# Altium project BMU_v50.PrjPcb (part 3 of 5)

## Sheet BMU_V50_CellBalanceIC.SchDoc
size C
Used 2 times, as channels StringA/U_BMU_V50_CellBalancer/U_BMU_V50_CellBalanceIC, StringB/U_BMU_V50_CellBalancer/U_BMU_V50_CellBalanceIC. Parts and nets are listed once, with the designators drawn on the sheet.
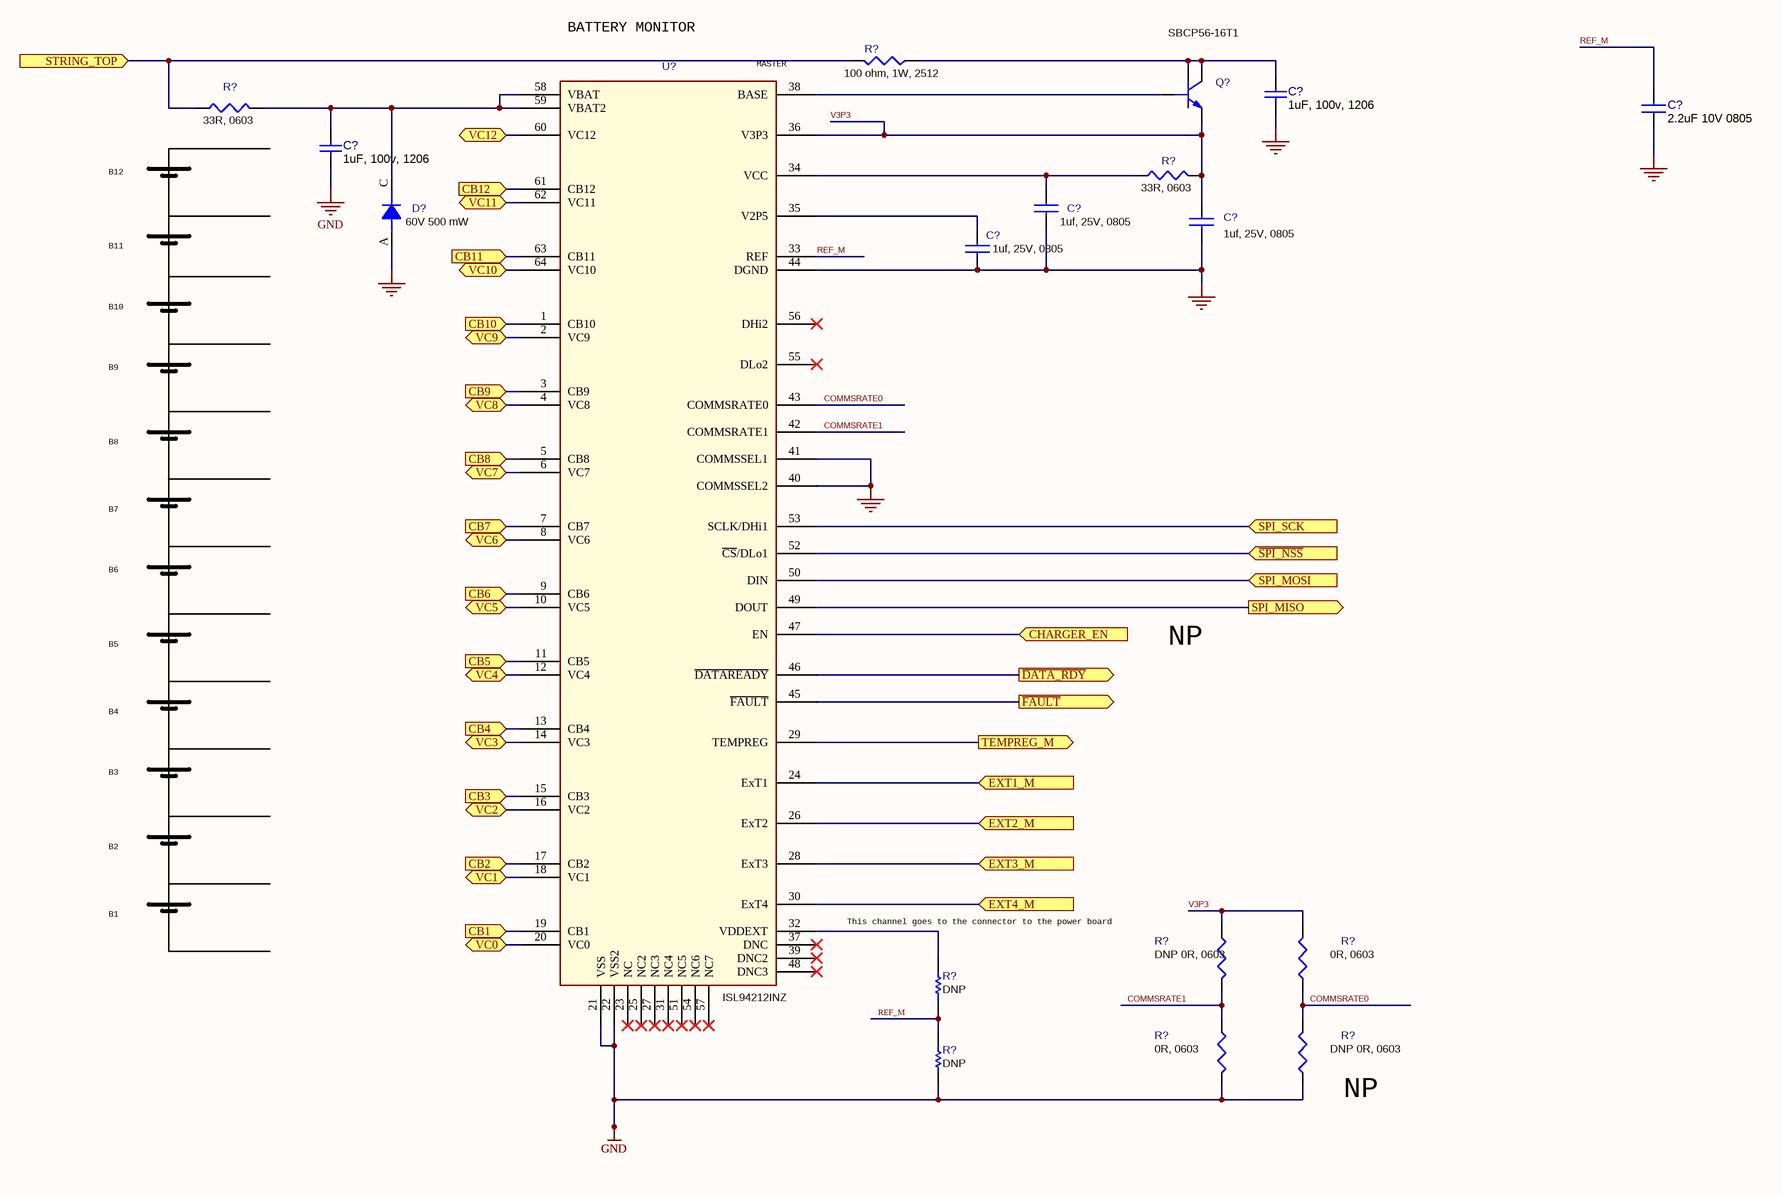
[diagram p6: BMU_V50_CellBalanceIC.SchDoc]

### Parts
(Parts that share a designator on the sheet are numbered #1, #2 ... from top to bottom, then left to right.)
C?#1  1uF, 100v, 1206  [C1206]
C?#2  2.2uF 10V 0805  [C0805]
C?#3  1uF, 100v, 1206  [C1206]
C?#4  1uf, 25V, 0805  [C0805]
C?#5  1uf, 25V, 0805  [C0805]
C?#6  1uf, 25V, 0805  [C0805]
D?  60V 500 mW  [SOD-123]
Q?  SBCP56-16T1  [SOT-223]
R?#1  100 ohm, 1W, 2512  [2512]
R?#2  33R, 0603  [R0603]
R?#3  33R, 0603  [R0603]
R?#4  DNP 0R, 0603  [R0603]  (no BOM)
R?#5  0R, 0603  [R0603]
R?#6  DNP  [R0402]  (no BOM)
R?#7  0R, 0603  [R0603]
R?#8  DNP 0R, 0603  [R0603]  (no BOM)
R?#9  DNP  [R0402]  (no BOM)
U?  ISL94212INZ  [TQFP-64]

### Ports
CB1 (in), CB2 (in), CB3 (in), CB4 (in), CB5 (in), CB6 (in), CB7 (in), CB8 (in), CB9 (in), CB10 (in), CB11 (in), CB12 (in), CHARGER_EN (in), EXT1_M (in), EXT2_M (in), EXT3_M (in), EXT4_M (in), SPI_MISO (out), SPI_MOSI (in), SPI_SCK (in), STRING_TOP (in), TEMPREG_M (out), VC0 (bidir), VC1 (bidir), VC2 (bidir), VC3 (bidir), VC4 (bidir), VC5 (bidir), VC6 (bidir), VC7 (bidir), VC8 (bidir), VC9 (bidir), VC10 (bidir), VC11 (bidir), VC12 (bidir), ~{DATA_RDY} (out), ~{FAULT} (out), ~{SPI_NSS} (in)

### Nets
GND: C?#1.2 C?#2.1 C?#3.1 C?#4.2 C?#5.2 C?#6.2 D?.A(ANODE) R?#7.2 R?#8.2 R?#9.1 U?.21(VSS) U?.22(VSS2) U?.40(COMMSSEL2) U?.41(COMMSSEL1) U?.44(DGND)
CB1: U?.19(CB1) ; port CB1
CB2: U?.17(CB2) ; port CB2
CB3: U?.15(CB3) ; port CB3
CB4: U?.13(CB4) ; port CB4
CB5: U?.11(CB5) ; port CB5
CB6: U?.9(CB6) ; port CB6
CB7: U?.7(CB7) ; port CB7
CB8: U?.5(CB8) ; port CB8
CB9: U?.3(CB9) ; port CB9
CB10: U?.1(CB10) ; port CB10
CB11: U?.63(CB11) ; port CB11
CB12: U?.61(CB12) ; port CB12
CHARGER_EN: U?.47(EN) ; port CHARGER_EN
COMMSRATE0: R?#5.2 R?#8.1 U?.43(COMMSRATE0)
COMMSRATE1: R?#4.2 R?#7.1 U?.42(COMMSRATE1)
~{DATA_RDY}: U?.46(~{DATAREADY}) ; port ~{DATA_RDY}
EXT1_M: U?.24(ExT1) ; port EXT1_M
EXT2_M: U?.26(ExT2) ; port EXT2_M
EXT3_M: U?.28(ExT3) ; port EXT3_M
EXT4_M: U?.30(ExT4) ; port EXT4_M
~{FAULT}: U?.45(~{FAULT}) ; port ~{FAULT}
REF_M: C?#2.2 R?#6.1 R?#9.2 U?.33(REF)
~{SPI_NSS}: U?.52(~{CS}/DLo1) ; port ~{SPI_NSS}
SPI_MISO: U?.49(DOUT) ; port SPI_MISO
SPI_MOSI: U?.50(DIN) ; port SPI_MOSI
SPI_SCK: U?.53(SCLK/DHi1) ; port SPI_SCK
STRING_TOP: R?#1.2 R?#2.1 ; port STRING_TOP
TEMPREG_M: U?.29(TEMPREG) ; port TEMPREG_M
V3P3: C?#5.1 Q?.3(E) R?#3.2 R?#4.1 R?#5.1 U?.36(V3P3)
VC0: U?.20(VC0) ; port VC0
VC1: U?.18(VC1) ; port VC1
VC2: U?.16(VC2) ; port VC2
VC3: U?.14(VC3) ; port VC3
VC4: U?.12(VC4) ; port VC4
VC5: U?.10(VC5) ; port VC5
VC6: U?.8(VC6) ; port VC6
VC7: U?.6(VC7) ; port VC7
VC8: U?.4(VC8) ; port VC8
VC9: U?.2(VC9) ; port VC9
VC10: U?.64(VC10) ; port VC10
VC11: U?.62(VC11) ; port VC11
VC12: U?.60(VC12) ; port VC12
NetC?#1_1: C?#1.1 Q?.2(C) Q?.4(C) R?#1.1
NetC?#3_2: C?#3.2 D?.C(CATHODE) R?#2.2 U?.58(VBAT) U?.59(VBAT2)
NetC?#4_1: C?#4.1 R?#3.1 U?.34(VCC)
NetC?#6_1: C?#6.1 U?.35(V2P5)
NetQ?_1: Q?.1(B) U?.38(BASE)
NetR?#6_2: R?#6.2 U?.32(VDDEXT)

Not connected (* = marked no-connect by the designer): U? 23(NC)* 25(NC2)* 27(NC3)* 31(NC4)* 37(DNC)* 39(DNC2)* 48(DNC3)* 51(NC5)* 54(NC6)* 55(DLo2)* 56(DHi2)* 57(NC7)*

### Channels
StringA/U_BMU_V50_CellBalancer/U_BMU_V50_CellBalanceIC: designators C?=C?_StringA_U_BMU_V50_CellBalancer_U_BMU_V50_CellBalanceIC#5 C?=C?_StringA_U_BMU_V50_CellBalancer_U_BMU_V50_CellBalanceIC#6 C?=C?_StringA_U_BMU_V50_CellBalancer_U_BMU_V50_CellBalanceIC#4 C?=C?_StringA_U_BMU_V50_CellBalancer_U_BMU_V50_CellBalanceIC#1 C?=C?_StringA_U_BMU_V50_CellBalancer_U_BMU_V50_CellBalanceIC#3 C?=C?_StringA_U_BMU_V50_CellBalancer_U_BMU_V50_CellBalanceIC#2 D?=D?_StringA_U_BMU_V50_CellBalancer_U_BMU_V50_CellBalanceIC Q?=Q?_StringA_U_BMU_V50_CellBalancer_U_BMU_V50_CellBalanceIC R?=R?_StringA_U_BMU_V50_CellBalancer_U_BMU_V50_CellBalanceIC#4 R?=R?_StringA_U_BMU_V50_CellBalancer_U_BMU_V50_CellBalanceIC#8 R?=R?_StringA_U_BMU_V50_CellBalancer_U_BMU_V50_CellBalanceIC#2 R?=R?_StringA_U_BMU_V50_CellBalancer_U_BMU_V50_CellBalanceIC#5 R?=R?_StringA_U_BMU_V50_CellBalancer_U_BMU_V50_CellBalanceIC#7 R?=R?_StringA_U_BMU_V50_CellBalancer_U_BMU_V50_CellBalanceIC#1 R?=R?_StringA_U_BMU_V50_CellBalancer_U_BMU_V50_CellBalanceIC#6 R?=R?_StringA_U_BMU_V50_CellBalancer_U_BMU_V50_CellBalanceIC#9 R?=R?_StringA_U_BMU_V50_CellBalancer_U_BMU_V50_CellBalanceIC#3 U?=U?_StringA_U_BMU_V50_CellBalancer_U_BMU_V50_CellBalanceIC; ports CB1=NetR?_StringA_U_BMU_V50_CellBalancer_U_BMU_V50_CellBalanceTaps#52_2 CB2=NetR?_StringA_U_BMU_V50_CellBalancer_U_BMU_V50_CellBalanceTaps#44_2 CB3=NetR?_StringA_U_BMU_V50_CellBalancer_U_BMU_V50_CellBalanceTaps#35_2 CB4=NetR?_StringA_U_BMU_V50_CellBalancer_U_BMU_V50_CellBalanceTaps#24_2 CB5=NetR?_StringA_U_BMU_V50_CellBalancer_U_BMU_V50_CellBalanceTaps#11_2 CB6=NetR?_StringA_U_BMU_V50_CellBalancer_U_BMU_V50_CellBalanceTaps#60_2 CB7=NetR?_StringA_U_BMU_V50_CellBalancer_U_BMU_V50_CellBalanceTaps#53_2 CB8=NetR?_StringA_U_BMU_V50_CellBalancer_U_BMU_V50_CellBalanceTaps#40_2 CB9=NetR?_StringA_U_BMU_V50_CellBalancer_U_BMU_V50_CellBalanceTaps#29_2 CB10=NetR?_StringA_U_BMU_V50_CellBalancer_U_BMU_V50_CellBalanceTaps#8_2 CB11=NetR?_StringA_U_BMU_V50_CellBalancer_U_BMU_V50_CellBalanceTaps#22_2 CB12=NetR?_StringA_U_BMU_V50_CellBalancer_U_BMU_V50_CellBalanceTaps#7_2 CHARGER_EN=NetU?#1_55 EXT1_M=NetR?_StringA_U_BMU_V50_CellBalancer_EXT_MEAS1#2_2 EXT2_M=NetR?_StringA_U_BMU_V50_CellBalancer_EXT_MEAS2#2_2 EXT3_M=NetR?_StringA_U_BMU_V50_CellBalancer_EXT_MEAS3#2_2 EXT4_M=NetR?_StringA_U_BMU_V50_CellBalancer_EXT_MEAS4#2_2 SPI_MISO=SPI_MISO SPI_MOSI=SPI_MOSI SPI_SCK=SPI_SCK STRING_TOP=NetC?_StringA_U_BMU_V50_StringPWRControl#1_1 TEMPREG_M=NetR?_StringA_U_BMU_V50_CellBalancer_EXT_MEAS1#1_2 VC0=NetC?_StringA_U_BMU_V50_CellBalancer_U_BMU_V50_CellBalanceTaps#33_1 VC1=NetC?_StringA_U_BMU_V50_CellBalancer_U_BMU_V50_CellBalanceTaps#28_1 VC2=NetC?_StringA_U_BMU_V50_CellBalancer_U_BMU_V50_CellBalanceTaps#23_1 VC3=NetC?_StringA_U_BMU_V50_CellBalancer_U_BMU_V50_CellBalanceTaps#17_1 VC4=NetC?_StringA_U_BMU_V50_CellBalancer_U_BMU_V50_CellBalanceTaps#11_1 VC5=NetC?_StringA_U_BMU_V50_CellBalancer_U_BMU_V50_CellBalanceTaps#2_1 VC6=NetC?_StringA_U_BMU_V50_CellBalancer_U_BMU_V50_CellBalanceTaps#35_1 VC7=NetC?_StringA_U_BMU_V50_CellBalancer_U_BMU_V50_CellBalanceTaps#29_1 VC8=NetC?_StringA_U_BMU_V50_CellBalancer_U_BMU_V50_CellBalanceTaps#22_1 VC9=NetC?_StringA_U_BMU_V50_CellBalancer_U_BMU_V50_CellBalanceTaps#10_1 VC10=NetC?_StringA_U_BMU_V50_CellBalancer_U_BMU_V50_CellBalanceTaps#7_1 VC11=NetC?_StringA_U_BMU_V50_CellBalancer_U_BMU_V50_CellBalanceTaps#12_1 VC12=NetC?_StringA_U_BMU_V50_CellBalancer_U_BMU_V50_CellBalanceTaps#1_1 ~{DATA_RDY}=NetU?#1_25 ~{FAULT}=NetD?#4_2 ~{SPI_NSS}=~{SPI_CS_BAL1}
StringB/U_BMU_V50_CellBalancer/U_BMU_V50_CellBalanceIC: designators C?=C?_StringB_U_BMU_V50_CellBalancer_U_BMU_V50_CellBalanceIC#5 C?=C?_StringB_U_BMU_V50_CellBalancer_U_BMU_V50_CellBalanceIC#6 C?=C?_StringB_U_BMU_V50_CellBalancer_U_BMU_V50_CellBalanceIC#4 C?=C?_StringB_U_BMU_V50_CellBalancer_U_BMU_V50_CellBalanceIC#1 C?=C?_StringB_U_BMU_V50_CellBalancer_U_BMU_V50_CellBalanceIC#3 C?=C?_StringB_U_BMU_V50_CellBalancer_U_BMU_V50_CellBalanceIC#2 D?=D?_StringB_U_BMU_V50_CellBalancer_U_BMU_V50_CellBalanceIC Q?=Q?_StringB_U_BMU_V50_CellBalancer_U_BMU_V50_CellBalanceIC R?=R?_StringB_U_BMU_V50_CellBalancer_U_BMU_V50_CellBalanceIC#4 R?=R?_StringB_U_BMU_V50_CellBalancer_U_BMU_V50_CellBalanceIC#8 R?=R?_StringB_U_BMU_V50_CellBalancer_U_BMU_V50_CellBalanceIC#2 R?=R?_StringB_U_BMU_V50_CellBalancer_U_BMU_V50_CellBalanceIC#5 R?=R?_StringB_U_BMU_V50_CellBalancer_U_BMU_V50_CellBalanceIC#7 R?=R?_StringB_U_BMU_V50_CellBalancer_U_BMU_V50_CellBalanceIC#1 R?=R?_StringB_U_BMU_V50_CellBalancer_U_BMU_V50_CellBalanceIC#6 R?=R?_StringB_U_BMU_V50_CellBalancer_U_BMU_V50_CellBalanceIC#9 R?=R?_StringB_U_BMU_V50_CellBalancer_U_BMU_V50_CellBalanceIC#3 U?=U?_StringB_U_BMU_V50_CellBalancer_U_BMU_V50_CellBalanceIC; ports CB1=NetR?_StringB_U_BMU_V50_CellBalancer_U_BMU_V50_CellBalanceTaps#52_2 CB2=NetR?_StringB_U_BMU_V50_CellBalancer_U_BMU_V50_CellBalanceTaps#44_2 CB3=NetR?_StringB_U_BMU_V50_CellBalancer_U_BMU_V50_CellBalanceTaps#35_2 CB4=NetR?_StringB_U_BMU_V50_CellBalancer_U_BMU_V50_CellBalanceTaps#24_2 CB5=NetR?_StringB_U_BMU_V50_CellBalancer_U_BMU_V50_CellBalanceTaps#11_2 CB6=NetR?_StringB_U_BMU_V50_CellBalancer_U_BMU_V50_CellBalanceTaps#60_2 CB7=NetR?_StringB_U_BMU_V50_CellBalancer_U_BMU_V50_CellBalanceTaps#53_2 CB8=NetR?_StringB_U_BMU_V50_CellBalancer_U_BMU_V50_CellBalanceTaps#40_2 CB9=NetR?_StringB_U_BMU_V50_CellBalancer_U_BMU_V50_CellBalanceTaps#29_2 CB10=NetR?_StringB_U_BMU_V50_CellBalancer_U_BMU_V50_CellBalanceTaps#8_2 CB11=NetR?_StringB_U_BMU_V50_CellBalancer_U_BMU_V50_CellBalanceTaps#22_2 CB12=NetR?_StringB_U_BMU_V50_CellBalancer_U_BMU_V50_CellBalanceTaps#7_2 CHARGER_EN=NetU?#1_55 EXT1_M=NetR?_StringB_U_BMU_V50_CellBalancer_EXT_MEAS1#2_2 EXT2_M=NetR?_StringB_U_BMU_V50_CellBalancer_EXT_MEAS2#2_2 EXT3_M=NetR?_StringB_U_BMU_V50_CellBalancer_EXT_MEAS3#2_2 EXT4_M=NetR?_StringB_U_BMU_V50_CellBalancer_EXT_MEAS4#2_2 SPI_MISO=SPI_MISO SPI_MOSI=SPI_MOSI SPI_SCK=SPI_SCK STRING_TOP=NetC?_StringB_U_BMU_V50_StringPWRControl#1_1 TEMPREG_M=NetR?_StringB_U_BMU_V50_CellBalancer_EXT_MEAS1#1_2 VC0=NetC?_StringB_U_BMU_V50_CellBalancer_U_BMU_V50_CellBalanceTaps#33_1 VC1=NetC?_StringB_U_BMU_V50_CellBalancer_U_BMU_V50_CellBalanceTaps#28_1 VC2=NetC?_StringB_U_BMU_V50_CellBalancer_U_BMU_V50_CellBalanceTaps#23_1 VC3=NetC?_StringB_U_BMU_V50_CellBalancer_U_BMU_V50_CellBalanceTaps#17_1 VC4=NetC?_StringB_U_BMU_V50_CellBalancer_U_BMU_V50_CellBalanceTaps#11_1 VC5=NetC?_StringB_U_BMU_V50_CellBalancer_U_BMU_V50_CellBalanceTaps#2_1 VC6=NetC?_StringB_U_BMU_V50_CellBalancer_U_BMU_V50_CellBalanceTaps#35_1 VC7=NetC?_StringB_U_BMU_V50_CellBalancer_U_BMU_V50_CellBalanceTaps#29_1 VC8=NetC?_StringB_U_BMU_V50_CellBalancer_U_BMU_V50_CellBalanceTaps#22_1 VC9=NetC?_StringB_U_BMU_V50_CellBalancer_U_BMU_V50_CellBalanceTaps#10_1 VC10=NetC?_StringB_U_BMU_V50_CellBalancer_U_BMU_V50_CellBalanceTaps#7_1 VC11=NetC?_StringB_U_BMU_V50_CellBalancer_U_BMU_V50_CellBalanceTaps#12_1 VC12=NetC?_StringB_U_BMU_V50_CellBalancer_U_BMU_V50_CellBalanceTaps#1_1 ~{DATA_RDY}=NetU?#1_37 ~{FAULT}=NetD?#5_2 ~{SPI_NSS}=~{SPI_CS_BAL2}

### Notes on the sheet
- BATTERY MONITOR
- (near U?) MASTER
- B12
- B11
- B10
- B9
- B8
- B7
- B6
- B5
- NP
- B4
- B3
- B2
- B1
- (near R?#6) This channel goes to the connector to the power board
- (near R?#8) NP
- Title
- MATTERNET
- PROPRIETRY & CONFIDENTIAL
  THE INFORMATION CONTAINS IN THIS DRAWING
  IS THE SOLE PROPERTY OF  MATTERNET Inc.
  ANY REPRODUCTION IN PART OR AS WHOLE
  WITHOUT A WRITTEN PERMISSION OF
  MATTERNET Inc. IS PROHIBITED
- Size:
- Date:
- File:
- C
- Number:
- Time:
- Revision:
- Sheet
- of
- 161 E. Evelyn Ave.
- Mountain View,
- CA 94041 USA

### Library data of the parts
C?#1 C?#3 = Cap: CAP CER 1UF 100V X7R 1210 AUTO F; Manufacturer: KEMET; Manufacturer Part Number: C1210X105K1RACAUTO; Dielectric Material: Ceramic; Tolerance: 10%; Supplier 1: Digi-Key; Supplier Part Number 1: 399-16434-1-ND; Stock 1: 335; Pricing 1: 1=2.07, 10=1.677, 100=1.2803, 500=0.9755, 1000=0.85356 (USD); Case/Package: 1210; Voltage Rating (DC): 100V; Dielectric: X7R; Capacitance: 1uF
C?#2 = CAP-Generic-0805: CAP CER 2.2UF 10V 10% X7R 0805; Manufacturer: KEMET; Manufacturer Part Number: C0805X225K8RACAUTO; Dielectric Material: Ceramic; Supplier 1: Digi-Key; Supplier Part Number 1: 399-11602-1-ND; Stock 1: 2328; Pricing 1: 1=0.9, 10=0.667, 100=0.4571, 500=0.36184, 1000=0.3047 (USD); Mount: Surface Mount; Case/Package: 0805; Case Code (Metric): 2012; Case Code (Imperial): 0805; Min Operating Temperature: -55°C; Max Operating Temperature: 125°C; Packaging: Tape and Reel; Capacitance: 2.2uF; Voltage Rating: 10V; Tolerance: 10%; Voltage Rating (DC): 10V; Dielectric: X7R; Features: Soft Termination; Length: 0.079inch; Width: 0.049inch; Thickness: 0.055inch; Ratings: AEC-Q200; Supplier 2: Mouser; Supplier Part Number 2: 80-C0805X225K8RAUTO; Stock 2: 4965; Pricing 2: 1=1.06, 10=0.715, 50=0.715, 100=0.446, 1000=0.369, 10000=0.228 (USD)
C?#4-C?#6 = CAP-Generic-0402: CAP CER 1UF 25V X7R 0805; Manufacturer: Murata; Manufacturer Part Number: GCJ21BR71E105KA12L; Tolerance: 10%; Supplier 1: Digi-Key; Supplier Part Number 1: 490-5802-1-ND; Stock 1: 116649; Pricing 1: 1=0.48, 10=0.333, 100=0.1997, 500=0.14974, 1000=0.12645 (USD); Mount: Surface Mount; Case/Package: 0805; Case Code (Imperial): 0805; Case Code (Metric): 2012; Min Operating Temperature: -55°C; Max Operating Temperature: 125°C; Capacitance: 1uF; Voltage Rating: 25V; Voltage Rating (DC): 25V; Packaging: Tape and Reel; Package Quantity: 3000; Dielectric: X7R; Termination: SMD/SMT; Features: Soft Termination; Length: 2mm; Width: 1.25mm; Thickness: 0.057inch; Depth: 1.25mm; Ratings: AEC-Q200; Lead Free: Lead Free
D? = DIO-GENERIC: DIODE ZENER 60V 500MW SOD123; Manufacturer: ON Semiconductor; Manufacturer Part Number: MMSZ5264BT1G; custprt: 100-0500-000184; custinv: Ansync; Option: AB; Material: Plastic; Tolerance: 5%; Impedance: 170R; Forward Voltage: 900mV; Max Reverse Leakage Current: 100nA; Zener Current: 10mA; Test Current: 2.1mA; Element Configuration: Single; ESD Protection: Yes; Supplier 1: Digi-Key; Supplier Part Number 1: MMSZ5264BT1GOSCT-ND; Stock 1: 0; Pricing 1: 1=0.25, 10=0.201, 100=0.1067, 500=0.07016, 1000=0.04771 (USD); Case/Package: SOD-123-2; Number of Pins: 2; Contact Plating: Matte,Tin; Min Operating Temperature: -55°C; Max Operating Temperature: 150°C; Packaging: Tape and Reel; Max Power Dissipation: 500mW; Zener Voltage: 60V; Voltage Rating (DC): 60V; Power Rating: 500mW; Package Quantity: 1; Voltage Tolerance: 5%; Power Dissipation: 500mW; Working Voltage: 60V; Peak Reverse Current: 100nA; Length: 2.84mm; Height: 1.25mm; Width: 1.8mm; Radiation Hardening: No; Lead Free: Lead Free; ComponentLink1URL: http://www.onsemi.com/pub/Collateral/MMSZ5221BT1-D.PDF; ComponentLink1Description: http://www.onsemi.com/pub/Collateral/MMSZ5221BT1-D.PDF; ComponentLink2URL: https://www.verical.com/server-webapp/html/getDatasheet?partID=107391; ComponentLink2Description: https://www.verical.com/server-webapp/html/getDatasheet?partID=107391; ComponentLink3URL: http://www.mouser.com/ds/2/308/MMSZ5221BT1-D-85810.pdf; ComponentLink3Description: http://www.mouser.com/ds/2/308/MMSZ5221BT1-D-85810.pdf; ComponentLink4URL: http://www.onsemi.com/pub_link/Collateral/MMSZ5221BT1-D.PDF; ComponentLink4Description: http://www.onsemi.com/pub_link/Collateral/MMSZ5221BT1-D.PDF; ComponentLink5URL: http://uk.rs-online.com/webdocs/1276/0900766b81276af2.pdf; ComponentLink5Description: http://uk.rs-online.com/webdocs/1276/0900766b81276af2.pdf; Supplier 2: Mouser; Supplier Part Number 2: 863-MMSZ5264BT1G; Stock 2: 694; Pricing 2: 1=0.23, 10=0.156, 50=0.156, 100=0.065, 1000=0.045, 10000=0.03 (USD)
Q? = Trans-Generic_2: TRANS NPN 80V 1.0A SOT-223; Manufacturer: ON Semiconductor; Manufacturer Part Number: SBCP56-16T1G; Max Power Dissipation: 1.5W; Frequency: 130MHz; hFE Min: 25; Max Collector Current: 1A; Collector Emitter Saturation Voltage: 500mV; Collector Base Voltage (VCBO): 100V; Number of Elements: 1; Emitter Base Voltage (VEBO): 5V; Element Configuration: Single; Supplier 1: Digi-Key; Supplier Part Number 1: SBCP56-16T1GOSCT-ND; Stock 1: 10870; Pricing 1: 1=0.59, 10=0.505, 100=0.3767, 500=0.29598 (USD); Case/Package: SOT-223-4; Number of Pins: 4; Min Operating Temperature: -65°C; Max Operating Temperature: 150°C; Package Quantity: 1000; Packaging: Tape and Reel; Collector Emitter Voltage (VCEO): 80V; Transition Frequency: 130MHz; Collector Emitter Breakdown Voltage: 80V; Polarity: NPN; Max Breakdown Voltage: 80V; Power Dissipation: 1.5W; Gain Bandwidth Product: 130MHz; Max Frequency: 130MHz; Length: 6.7mm; Height: 1.65mm; Width: 3.7mm; Radiation Hardening: No; Lead Free: Lead Free; ComponentLink1URL: http://www.onsemi.com/pub/Collateral/BCP56T1-D.PDF?src-supplier=Digi-Key; ComponentLink1Description: http://www.onsemi.com/pub/Collateral/BCP56T1-D.PDF?src-supplier=Digi-Key; ComponentLink2URL: http://www.onsemi.com/pub_link/Collateral/BCP56T1-D.PDF?src-supplier=Future+Electronics; ComponentLink2Description: http://www.onsemi.com/pub_link/Collateral/BCP56T1-D.PDF?src-supplier=Future+Electronics; ComponentLink3URL: http://www.onsemi.com/pub/Collateral/BCP56T1-D.PDF?src-supplier=Avnet+Europe; ComponentLink3Description: http://www.onsemi.com/pub/Collateral/BCP56T1-D.PDF?src-supplier=Avnet+Europe; Supplier 2: Mouser; Supplier Part Number 2: 863-SBCP56-16T1G; Stock 2: 108192; Pricing 2: 1=0.55, 10=0.45, 50=0.45, 100=0.274, 1000=0.212, 10000=0.168 (USD)
R?#1 = R-Generic: RES SMD 100 OHM 5% 1W 2512; Manufacturer: Panasonic; Manufacturer Part Number: ERJ-1TYJ101U; custprt: 100-0100-000214; custinv: Ansync; Option: AB; Resistance: 100R; Temperature Coefficient: 200ppm/°C; Voltage Rating: 200V; Voltage Rating (DC): 250V; Supplier 1: Mouser; Supplier Part Number 1: 667-ERJ-1TYJ101U; Stock 1: 275; Pricing 1: 1=0.39, 10=0.28, 50=0.169, 100=0.125, 1000=0.07, 10000=0.053 (USD); Mount: Surface Mount; Case/Package: 2512; Contact Plating: Tin; Case Code (Metric): 6432; Case Code (Imperial): 2512; Min Operating Temperature: -55°C; Max Operating Temperature: 155°C; Tolerance: 5%; Power Rating: 1W; Composition: Thick Film; Packaging: Tape and Reel; Package Quantity: 4000; Number of Terminations: 2; Termination: SMD/SMT; Military Standard: Not; Max Power Dissipation: 1W; Features: Automotive AEC-Q200; Length: 6.4mm; Height: 0.6mm; Width: 0.126inch; Depth: 3.2mm; Radiation Hardening: No; REACH SVHC: No SVHC; Lead Free: Lead Free; ComponentLink1URL: http://www.farnell.com/datasheets/1678796.pdf; ComponentLink1Description: http://www.farnell.com/datasheets/1678796.pdf; ComponentLink2URL: http://industrial.panasonic.com/www-data/pdf/AOA0000/AOA0000CE1.pdf; ComponentLink2Description: http://industrial.panasonic.com/www-data/pdf/AOA0000/AOA0000CE1.pdf; ComponentLink3URL: http://www.mouser.com/ds/2/315/AOA0000C84-947596.pdf; ComponentLink3Description: http://www.mouser.com/ds/2/315/AOA0000C84-947596.pdf; ComponentLink4URL: https://www.alliedelec.com/m/d/51cd0790071e1666bdb9d00c57fcf960.pdf; ComponentLink4Description: https://www.alliedelec.com/m/d/51cd0790071e1666bdb9d00c57fcf960.pdf
R?#2 R?#3 = R-Generic-0603: RES SMD 33 OHM 1% 1/10W 0603; Manufacturer: Yageo; Manufacturer Part Number: AC0603FR-0733RL; custprt: 100-0110-000153; custinv: Ansync; Option: AB; Power Rating: 100mW; Voltage Rating: 50V; Temperature Coefficient: 100ppm/°C; Supplier 1: Digi-Key; Supplier Part Number 1: YAG3599CT-ND; Stock 1: 70551; Pricing 1: 1=0.1, 10=0.032, 100=0.0129, 1000=0.00579, 2500=0.00502 (USD); Case/Package: 0603; Case Code (Imperial): 0603; Case Code (Metric): 1608; Min Operating Temperature: -55°C; Max Operating Temperature: 155°C; Packaging: Tape and Reel; Resistance: 33R; Tolerance: 1%; Composition: Thick Film; Termination: SMD/SMT; Number of Terminations: 2; Max Power Dissipation: 100mW; Features: Automotive AEC-Q200,Moisture Resistant; Length: 0.063inch; Height: 0.022inch; Width: 0.8mm
R?#4 R?#8 = R-Generic-0402: DNP; custinv: Ansync; custprt: 100-0120-000002; Option: N
R?#5 R?#7 = R-Generic-0402: RES SMD 0 OHM JUMPER 1/10W 0603; Manufacturer: Yageo; Manufacturer Part Number: RC0603FR-070RL; custinv: Ansync; custprt: 100-0120-000002; Option: AB; Resistance: 0mR; Power Rating: 100mW; Tolerance: 1%; Voltage Rating (DC): 50V; Temperature Coefficient: 200ppm/°C; Current Rating: 1A; Working Voltage: 75V; Supplier 1: Digi-Key; Supplier Part Number 1: 311-0.0HRCT-ND; Stock 1: 3289463; Pricing 1: 1=0.1, 10=0.021, 25=0.0152, 50=0.0114, 100=0.0084, 250=0.00644, 500=0.00514, 1000=0.00379 (USD); Case/Package: 0603; Number of Pins: 2; Contact Plating: Matte,Tin; Case Code (Metric): 1608; Case Code (Imperial): 0603; Min Operating Temperature: -55°C; Max Operating Temperature: 155°C; Composition: Thick Film; Packaging: Tape and Reel; Package Quantity: 5000; Voltage Rating: 50V; Number of Terminations: 2; Termination: SMD/SMT; Military Standard: Not; Max Power Dissipation: 100mW; Features: Moisture Resistant; Length: 1.6mm; Height: 0.45mm; Width: 0.031inch; Depth: 0.8mm; Radiation Hardening: No; REACH SVHC: No SVHC; Lead Free: Lead Free; ComponentLink1URL: http://www.farnell.com/datasheets/1868787.pdf; ComponentLink1Description: http://www.farnell.com/datasheets/1868787.pdf; ComponentLink2URL: http://www.farnell.com/datasheets/443971.pdf; ComponentLink2Description: http://www.farnell.com/datasheets/443971.pdf; ComponentLink3URL: http://www.yageo.com/documents/recent/PYu-RC_Group_51_RoHS_L_9.pdf; ComponentLink3Description: http://www.yageo.com/documents/recent/PYu-RC_Group_51_RoHS_L_9.pdf; ComponentLink4URL: http://documents.rs-components.com/techlib://itc_doclist_GB.htm?stockno=5048827; ComponentLink4Description: http://documents.rs-components.com/techlib://itc_doclist_GB.htm?stockno=5048827
R?#6 R?#9 = Res1: Resistor; Published: 8-Jun-2000; LatestRevisionDate: 17-Jul-2002; LatestRevisionNote: Re-released for DXP Platform.; PackageReference: AXIAL-0.3; Publisher: Altium Limited; PackageDescription: Axial Device, Thru-Hole; 2 Leads; 0.3 in Pin Spacing
U? = BATTMAN-ISL94212INZ-700-498: Battery Management Multi-Cell Li-Ion Battery Manager; Manufacturer: Renesas; Option: AB; Max Supply Current: 5mA; Mount: Surface Mount; Case/Package: QFP; Number of Pins: 64; Min Operating Temperature: -40°C; Max Operating Temperature: 85°C; Package Quantity: 160; Packaging: Tray; Radiation Hardening: No; ComponentLink1URL: http://www.intersil.com/products/deviceinfo.asp?pn=ISL94212; ComponentLink1Description: http://www.intersil.com/products/deviceinfo.asp?pn=ISL94212; ComponentLink2URL: http://www.intersil.com/content/dam/Intersil/documents/isl9/isl94212.pdf; ComponentLink2Description: http://www.intersil.com/content/dam/Intersil/documents/isl9/isl94212.pdf; Supplier 1: Mouser; Supplier Part Number 1: 968-ISL94212INZ; Stock 1: 447; Pricing 1: 1=11.53, 10=10.42, 50=9.94, 100=8.63, 1000=6.55, 10000=6.55 (USD); Manufacturer Part Number: ISL94212INZ

## Sheet BMU_V50_EXT_MEAS.SchDoc
size C
Used 8 times, as channels StringA/U_BMU_V50_CellBalancer/EXT_MEAS1, StringA/U_BMU_V50_CellBalancer/EXT_MEAS2, StringA/U_BMU_V50_CellBalancer/EXT_MEAS3, StringA/U_BMU_V50_CellBalancer/EXT_MEAS4, StringB/U_BMU_V50_CellBalancer/EXT_MEAS1, StringB/U_BMU_V50_CellBalancer/EXT_MEAS2, StringB/U_BMU_V50_CellBalancer/EXT_MEAS3, StringB/U_BMU_V50_CellBalancer/EXT_MEAS4. Parts and nets are listed once, with the designators drawn on the sheet.
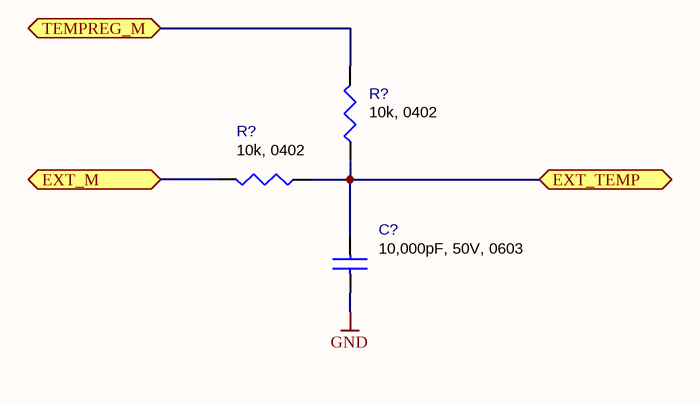
[diagram p7: BMU_V50_EXT_MEAS.SchDoc]

### Parts
(Parts that share a designator on the sheet are numbered #1, #2 ... from top to bottom, then left to right.)
C?  10,000pF, 50V, 0603  [C0603]
R?#1  10k, 0402  [R0402]
R?#2  10k, 0402  [R0402]

### Ports
EXT_M (bidir), EXT_TEMP (bidir), TEMPREG_M (bidir)

### Nets
GND: C?.2
EXT_M: R?#2.2 ; port EXT_M
EXT_TEMP: C?.1 R?#1.1 R?#2.1 ; port EXT_TEMP
TEMPREG_M: R?#1.2 ; port TEMPREG_M

### Channels
StringA/U_BMU_V50_CellBalancer/EXT_MEAS1: designators C?=C?_StringA_U_BMU_V50_CellBalancer_EXT_MEAS1 R?=R?_StringA_U_BMU_V50_CellBalancer_EXT_MEAS1#2 R?=R?_StringA_U_BMU_V50_CellBalancer_EXT_MEAS1#1; ports EXT_M=NetR?_StringA_U_BMU_V50_CellBalancer_EXT_MEAS1#2_2 EXT_TEMP=NetC?_StringA_U_BMU_V50_CellBalancer_EXT_MEAS1_1 TEMPREG_M=NetR?_StringA_U_BMU_V50_CellBalancer_EXT_MEAS1#1_2
StringA/U_BMU_V50_CellBalancer/EXT_MEAS2: designators C?=C?_StringA_U_BMU_V50_CellBalancer_EXT_MEAS2 R?=R?_StringA_U_BMU_V50_CellBalancer_EXT_MEAS2#2 R?=R?_StringA_U_BMU_V50_CellBalancer_EXT_MEAS2#1; ports EXT_M=NetR?_StringA_U_BMU_V50_CellBalancer_EXT_MEAS2#2_2 EXT_TEMP=NetC?_StringA_U_BMU_V50_CellBalancer_EXT_MEAS2_1 TEMPREG_M=NetR?_StringA_U_BMU_V50_CellBalancer_EXT_MEAS1#1_2
StringA/U_BMU_V50_CellBalancer/EXT_MEAS3: designators C?=C?_StringA_U_BMU_V50_CellBalancer_EXT_MEAS3 R?=R?_StringA_U_BMU_V50_CellBalancer_EXT_MEAS3#2 R?=R?_StringA_U_BMU_V50_CellBalancer_EXT_MEAS3#1; ports EXT_M=NetR?_StringA_U_BMU_V50_CellBalancer_EXT_MEAS3#2_2 EXT_TEMP=NetC?_StringA_U_BMU_V50_CellBalancer_EXT_MEAS3_1 TEMPREG_M=NetR?_StringA_U_BMU_V50_CellBalancer_EXT_MEAS1#1_2
StringA/U_BMU_V50_CellBalancer/EXT_MEAS4: designators C?=C?_StringA_U_BMU_V50_CellBalancer_EXT_MEAS4 R?=R?_StringA_U_BMU_V50_CellBalancer_EXT_MEAS4#2 R?=R?_StringA_U_BMU_V50_CellBalancer_EXT_MEAS4#1; ports EXT_M=NetR?_StringA_U_BMU_V50_CellBalancer_EXT_MEAS4#2_2 EXT_TEMP=NetC?_StringA_U_BMU_V50_CellBalancer_EXT_MEAS4_1 TEMPREG_M=NetR?_StringA_U_BMU_V50_CellBalancer_EXT_MEAS1#1_2
StringB/U_BMU_V50_CellBalancer/EXT_MEAS1: designators C?=C?_StringB_U_BMU_V50_CellBalancer_EXT_MEAS1 R?=R?_StringB_U_BMU_V50_CellBalancer_EXT_MEAS1#2 R?=R?_StringB_U_BMU_V50_CellBalancer_EXT_MEAS1#1; ports EXT_M=NetR?_StringB_U_BMU_V50_CellBalancer_EXT_MEAS1#2_2 EXT_TEMP=NetC?_StringB_U_BMU_V50_CellBalancer_EXT_MEAS1_1 TEMPREG_M=NetR?_StringB_U_BMU_V50_CellBalancer_EXT_MEAS1#1_2
StringB/U_BMU_V50_CellBalancer/EXT_MEAS2: designators C?=C?_StringB_U_BMU_V50_CellBalancer_EXT_MEAS2 R?=R?_StringB_U_BMU_V50_CellBalancer_EXT_MEAS2#2 R?=R?_StringB_U_BMU_V50_CellBalancer_EXT_MEAS2#1; ports EXT_M=NetR?_StringB_U_BMU_V50_CellBalancer_EXT_MEAS2#2_2 EXT_TEMP=NetC?_StringB_U_BMU_V50_CellBalancer_EXT_MEAS2_1 TEMPREG_M=NetR?_StringB_U_BMU_V50_CellBalancer_EXT_MEAS1#1_2
StringB/U_BMU_V50_CellBalancer/EXT_MEAS3: designators C?=C?_StringB_U_BMU_V50_CellBalancer_EXT_MEAS3 R?=R?_StringB_U_BMU_V50_CellBalancer_EXT_MEAS3#2 R?=R?_StringB_U_BMU_V50_CellBalancer_EXT_MEAS3#1; ports EXT_M=NetR?_StringB_U_BMU_V50_CellBalancer_EXT_MEAS3#2_2 EXT_TEMP=NetC?_StringB_U_BMU_V50_CellBalancer_EXT_MEAS3_1 TEMPREG_M=NetR?_StringB_U_BMU_V50_CellBalancer_EXT_MEAS1#1_2
StringB/U_BMU_V50_CellBalancer/EXT_MEAS4: designators C?=C?_StringB_U_BMU_V50_CellBalancer_EXT_MEAS4 R?=R?_StringB_U_BMU_V50_CellBalancer_EXT_MEAS4#2 R?=R?_StringB_U_BMU_V50_CellBalancer_EXT_MEAS4#1; ports EXT_M=NetR?_StringB_U_BMU_V50_CellBalancer_EXT_MEAS4#2_2 EXT_TEMP=NetC?_StringB_U_BMU_V50_CellBalancer_EXT_MEAS4_1 TEMPREG_M=NetR?_StringB_U_BMU_V50_CellBalancer_EXT_MEAS1#1_2

### Notes on the sheet
- Title
- MATTERNET
- PROPRIETRY & CONFIDENTIAL
  THE INFORMATION CONTAINS IN THIS DRAWING
  IS THE SOLE PROPERTY OF  MATTERNET Inc.
  ANY REPRODUCTION IN PART OR AS WHOLE
  WITHOUT A WRITTEN PERMISSION OF
  MATTERNET Inc. IS PROHIBITED
- Size:
- Date:
- File:
- C
- Number:
- Time:
- Revision:
- Sheet
- of
- 161 E. Evelyn Ave.
- Mountain View,
- CA 94041 USA

### Library data of the parts
C? = CAP-Generic-0603: as C?#3 on sheet BMU_V50_CellBalanceTaps; Supplier 1: Digi-Key; Supplier Part Number 1: 445-15955-1-ND; Stock 1: 42633; Pricing 1: 1=0.27, 10=0.186, 100=0.0944, 500=0.06458, 1000=0.05713 (USD); Mount: Surface Mount; Case/Package: 0603; Weight: 7.1E-05oz; Case Code (Metric): 1608; Case Code (Imperial): 0603; Min Operating Temperature: -55°C; Max Operating Temperature: 125°C; Package Quantity: 4000; Packaging: Tape and Reel; Voltage Rating: 50V; Dielectric: X7R; Termination: SMD/SMT; Voltage Rating (DC): 50V; Features: Soft Termination; Length: 0.063inch; Height: 0.8mm; Width: 0.031inch; Thickness: 0.035inch; Ratings: AEC-Q200
R?#1 R?#2 = R-Generic-0402: RES SMD 10K OHM 1% 1/16W 0402; Manufacturer: Vishay Dale; Manufacturer Part Number: CRCW040210K0FKTD; Resistance: 10kR; Power Rating: 63mW; Voltage Rating: 50V; Temperature Coefficient: 100ppm/°C; ComponentLink1URL: http://www.yageo.com/documents/recent/PYu-RC_Group_51_RoHS_L_9.pdf; ComponentLink1Description: http://www.yageo.com/documents/recent/PYu-RC_Group_51_RoHS_L_9.pdf; ComponentLink2URL: http://www.mouser.com/ds/2/447/PYu-RC0402_51_RoHS_L_6_r-8721.pdf; ComponentLink2Description: http://www.mouser.com/ds/2/447/PYu-RC0402_51_RoHS_L_6_r-8721.pdf; ComponentLink3URL: http://www.farnell.com/datasheets/1018594.pdf; ComponentLink3Description: http://www.farnell.com/datasheets/1018594.pdf; Supplier 1: Digi-Key; Supplier Part Number 1: 541-2955-1-ND; Stock 1: 17223; Pricing 1: 1=0.15, 10=0.132, 100=0.0508, 1000=0.02236, 2500=0.01931, 5000=0.01728 (USD); Mount: Surface Mount; Case/Package: 0402; Number of Pins: 2; Weight: 2.3E-05oz; Case Code (Metric): 1005; Case Code (Imperial): 0402; Contact Plating: Lead,Tin; Min Operating Temperature: -55°C; Max Operating Temperature: 155°C; Tolerance: 1%; Packaging: Tape and Reel; Package Quantity: 10000; Composition: Thick Film; Number of Terminations: 2; Military Standard: Not; Max Power Dissipation: 63mW; Voltage Rating (DC): 50V; Features: Automotive AEC-Q200; Length: 1mm; Height: 0.016inch; Width: 0.02inch; Depth: 0.5mm; Radiation Hardening: No; Lead Free: Contains Lead; REACH SVHC: Unknown; ComponentLink4URL: http://www.vishay.com/docs/20008/dcrcw.pdf?src-supplier=Digi-Key; ComponentLink4Description: http://www.vishay.com/docs/20008/dcrcw.pdf?src-supplier=Digi-Key; ComponentLink5URL: https://www.verical.com/server-webapp/html/getDatasheet?partID=104182&src-supplier=Verical; ComponentLink5Description: https://www.verical.com/server-webapp/html/getDatasheet?partID=104182&src-supplier=Verical; ComponentLink6URL: http://www.vishay.com/docs/20008/dcrcw.pdf?src-supplier=Avnet; ComponentLink6Description: http://www.vishay.com/docs/20008/dcrcw.pdf?src-supplier=Avnet

## Sheet BMU_V50_StringPWRControl.SchDoc
size C
Used 2 times, as channels StringA/U_BMU_V50_StringPWRControl, StringB/U_BMU_V50_StringPWRControl. Parts and nets are listed once, with the designators drawn on the sheet.
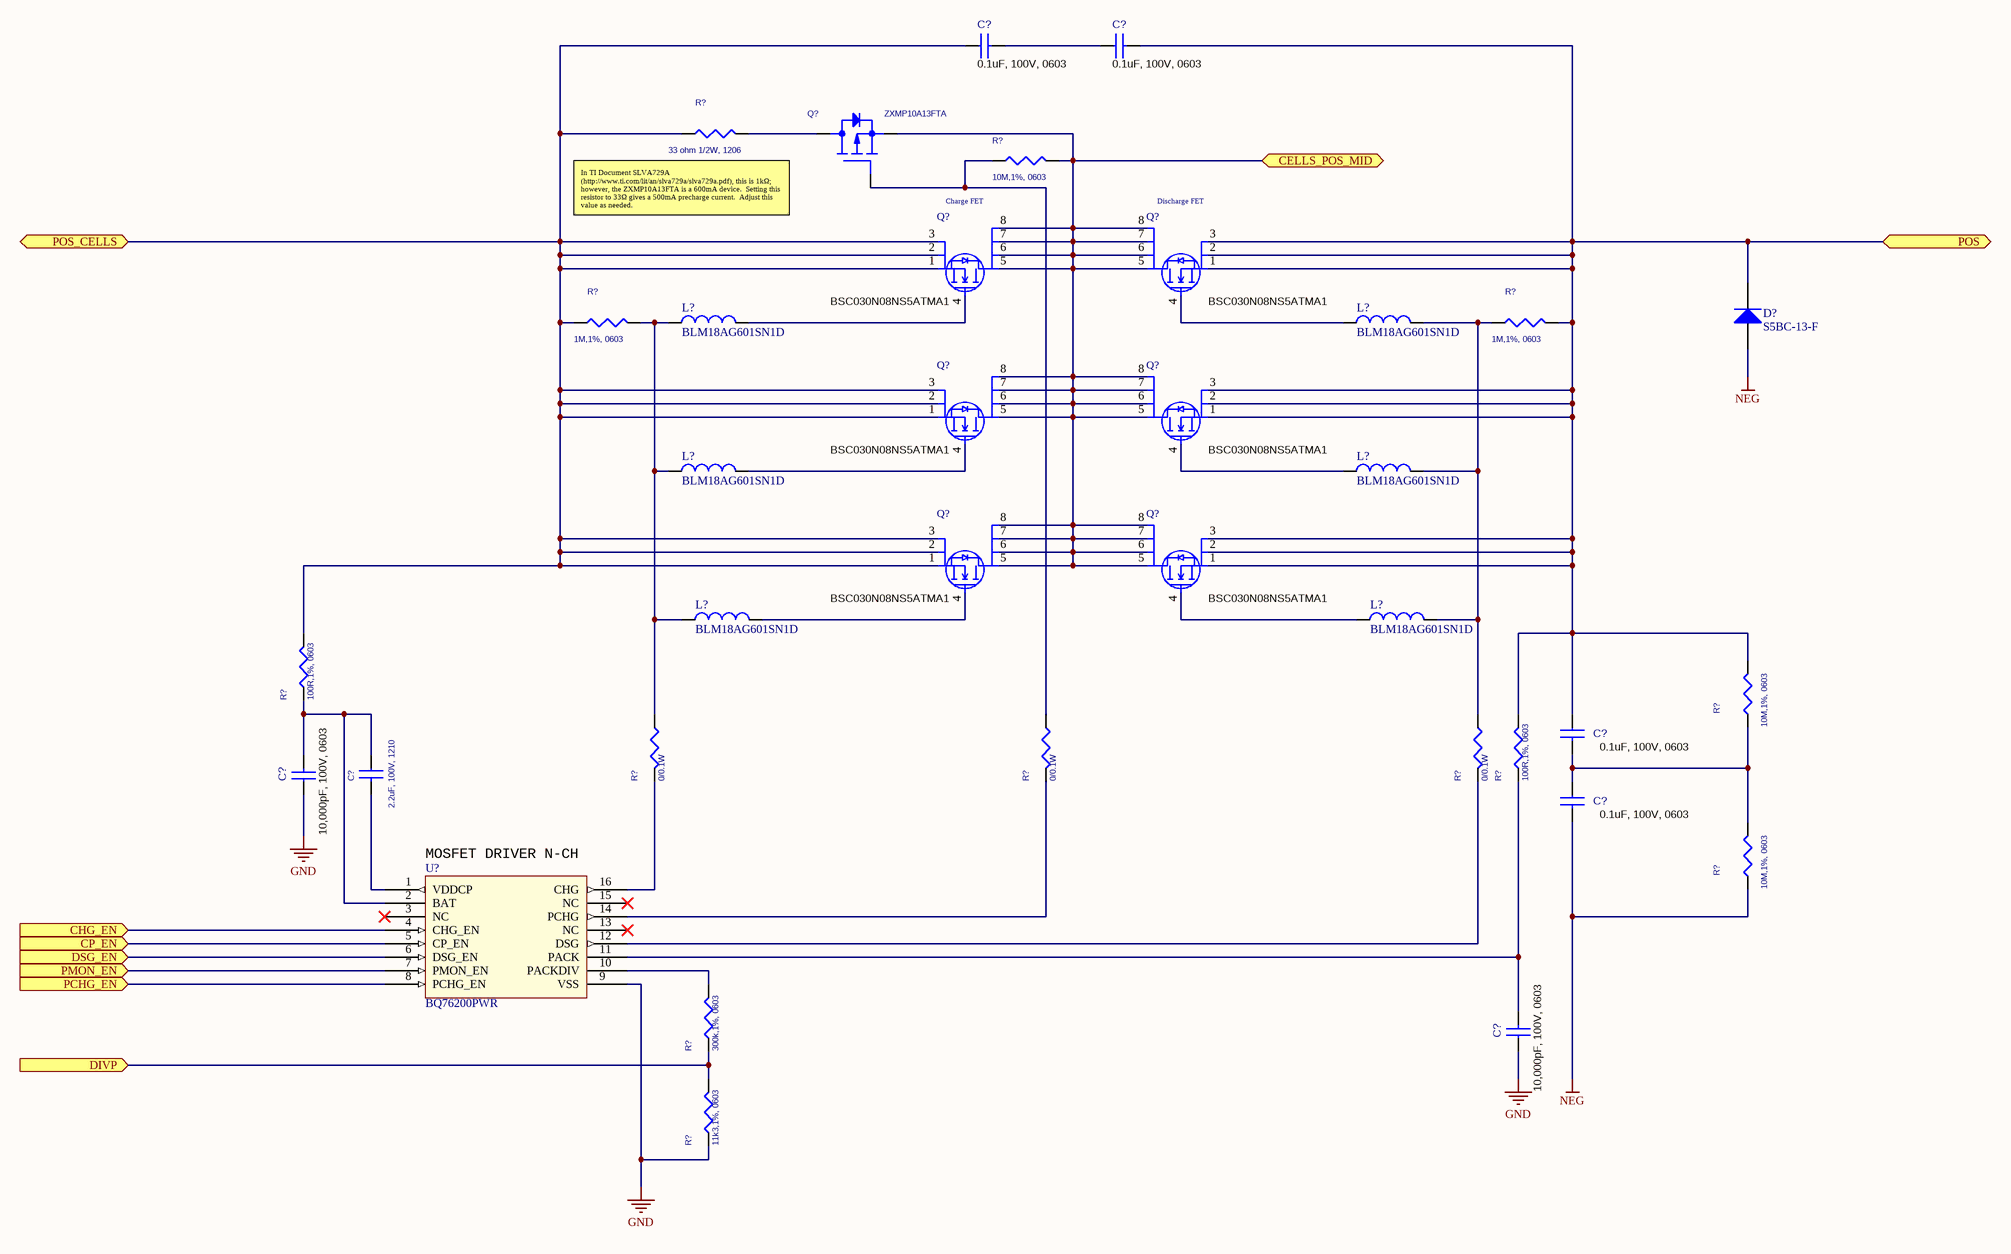
[diagram p8: BMU_V50_StringPWRControl.SchDoc]

### Parts
(Parts that share a designator on the sheet are numbered #1, #2 ... from top to bottom, then left to right.)
C?#1  0.1uF, 100V, 0603  [C0603]
C?#2  0.1uF, 100V, 0603  [C0603]
C?#3  0.1uF, 100V, 0603  [C0603]
C?#4  2.2uF, 100V, 1210  [C1210]
C?#5  10,000pF, 100V, 0603  [C0603]
C?#6  0.1uF, 100V, 0603  [C0603]
C?#7  10,000pF, 100V, 0603  [C0603]
D?  S5BC-13-F  [DIOD-S5xC_V]
L?#1  BLM18AG601SN1D  [INDC1608X10N]
L?#2  BLM18AG601SN1D  [INDC1608X10N]
L?#3  BLM18AG601SN1D  [INDC1608X10N]
L?#4  BLM18AG601SN1D  [INDC1608X10N]
L?#5  BLM18AG601SN1D  [INDC1608X10N]
L?#6  BLM18AG601SN1D  [INDC1608X10N]
Q?#1  ZXMP10A13FTA  [SOT-23]
Q?#2  BSC030N08NS5ATMA1  [8TDSON]
Q?#3  BSC030N08NS5ATMA1  [8TDSON]
Q?#4  BSC030N08NS5ATMA1  [8TDSON]
Q?#5  BSC030N08NS5ATMA1  [8TDSON]
Q?#6  BSC030N08NS5ATMA1  [8TDSON]
Q?#7  BSC030N08NS5ATMA1  [8TDSON]
R?#1  33 ohm 1/2W, 1206  [R1206]
R?#2  10M,1%, 0603  [R0603]
R?#3  1M,1%, 0603  [R0603]
R?#4  1M,1%, 0603  [R0603]
R?#5  100R,1%, 0603  [R0603]
R?#6  10M,1%, 0603  [R0603]
R?#7  0/0.1W  [R0603]
R?#8  0/0.1W  [R0603]
R?#9  0/0.1W  [R0603]
R?#10  100R,1%, 0603  [R0603]
R?#11  10M,1%, 0603  [R0603]
R?#12  300k,1%, 0603  [R0603]
R?#13  11k3,1%, 0603  [R0603]
U?  BQ76200PWR  [PW16]

### Ports
CELLS_POS_MID (bidir), CHG_EN (in), CP_EN (in), DIVP (in), DSG_EN (in), PCHG_EN (in), PMON_EN (in), POS (bidir), POS_CELLS (bidir)

### Nets
GND: C?#5.1 C?#7.1 R?#13.1 U?.9(VSS)
NEG: C?#6.2 D?.1(A) R?#11.1
CELLS_POS_MID: Q?#1.S Q?#2.5(D1) Q?#2.6(D2) Q?#2.7(D3) Q?#2.8(D4) Q?#3.5(D1) Q?#3.6(D2) Q?#3.7(D3) Q?#3.8(D4) Q?#4.5(D1) Q?#4.6(D2) Q?#4.7(D3) Q?#4.8(D4) Q?#5.5(D1) Q?#5.6(D2) Q?#5.7(D3) Q?#5.8(D4) Q?#6.5(D1) Q?#6.6(D2) Q?#6.7(D3) Q?#6.8(D4) Q?#7.5(D1) Q?#7.6(D2) Q?#7.7(D3) Q?#7.8(D4) R?#2.2 ; port CELLS_POS_MID
CHG_EN: U?.4(CHG_EN) ; port CHG_EN
CP_EN: U?.5(CP_EN) ; port CP_EN
DIVP: R?#12.1 R?#13.2 ; port DIVP
DSG_EN: U?.6(DSG_EN) ; port DSG_EN
PCHG_EN: U?.8(PCHG_EN) ; port PCHG_EN
PMON_EN: U?.7(PMON_EN) ; port PMON_EN
POS: C?#2.2 C?#3.1 D?.2(K) Q?#3.1(S1) Q?#3.2(S2) Q?#3.3(S3) Q?#5.1(S1) Q?#5.2(S2) Q?#5.3(S3) Q?#7.1(S1) Q?#7.2(S2) Q?#7.3(S3) R?#4.2 R?#6.2 R?#10.2 ; port POS
POS_CELLS: C?#1.1 Q?#2.1(S1) Q?#2.2(S2) Q?#2.3(S3) Q?#4.1(S1) Q?#4.2(S2) Q?#4.3(S3) Q?#6.1(S1) Q?#6.2(S2) Q?#6.3(S3) R?#1.1 R?#3.1 R?#5.2 ; port POS_CELLS
NetC?#1_2: C?#1.2 C?#2.1
NetC?#3_2: C?#3.2 C?#6.1 R?#6.1 R?#11.2
NetC?#4_1: C?#4.1 C?#5.2 R?#5.1 U?.2(BAT)
NetC?#4_2: C?#4.2 U?.1(VDDCP)
NetC?#7_2: C?#7.2 R?#10.1 U?.11(PACK)
NetL?#1_1: L?#1.1 L?#3.1 L?#5.1 R?#3.2 R?#7.1
NetL?#1_2: L?#1.2 Q?#2.4(G)
NetL?#2_1: L?#2.1 Q?#3.4(G)
NetL?#2_2: L?#2.2 L?#4.2 L?#6.2 R?#4.1 R?#9.1
NetL?#3_2: L?#3.2 Q?#4.4(G)
NetL?#4_1: L?#4.1 Q?#5.4(G)
NetL?#5_2: L?#5.2 Q?#6.4(G)
NetL?#6_1: L?#6.1 Q?#7.4(G)
NetQ?#1_D: Q?#1.D R?#1.2
NetQ?#1_G: Q?#1.G R?#2.1 R?#8.1
NetR?#7_2: R?#7.2 U?.16(CHG)
NetR?#8_2: R?#8.2 U?.14(PCHG)
NetR?#9_2: R?#9.2 U?.12(DSG)
NetR?#12_2: R?#12.2 U?.10(PACKDIV)

Not connected (* = marked no-connect by the designer): U? 3(NC)* 13(NC)* 15(NC)*

### Channels
StringA/U_BMU_V50_StringPWRControl: designators C?=C?_StringA_U_BMU_V50_StringPWRControl#3 C?=C?_StringA_U_BMU_V50_StringPWRControl#6 C?=C?_StringA_U_BMU_V50_StringPWRControl#2 C?=C?_StringA_U_BMU_V50_StringPWRControl#1 C?=C?_StringA_U_BMU_V50_StringPWRControl#7 C?=C?_StringA_U_BMU_V50_StringPWRControl#5 C?=C?_StringA_U_BMU_V50_StringPWRControl#4 D?=D?_StringA_U_BMU_V50_StringPWRControl L?=L?_StringA_U_BMU_V50_StringPWRControl#1 L?=L?_StringA_U_BMU_V50_StringPWRControl#3 L?=L?_StringA_U_BMU_V50_StringPWRControl#5 L?=L?_StringA_U_BMU_V50_StringPWRControl#2 L?=L?_StringA_U_BMU_V50_StringPWRControl#4 L?=L?_StringA_U_BMU_V50_StringPWRControl#6 Q?=Q?_StringA_U_BMU_V50_StringPWRControl#3 Q?=Q?_StringA_U_BMU_V50_StringPWRControl#2 Q?=Q?_StringA_U_BMU_V50_StringPWRControl#5 Q?=Q?_StringA_U_BMU_V50_StringPWRControl#4 Q?=Q?_StringA_U_BMU_V50_StringPWRControl#7 Q?=Q?_StringA_U_BMU_V50_StringPWRControl#6 Q?=Q?_StringA_U_BMU_V50_StringPWRControl#1 R?=R?_StringA_U_BMU_V50_StringPWRControl#3 R?=R?_StringA_U_BMU_V50_StringPWRControl#4 R?=R?_StringA_U_BMU_V50_StringPWRControl#7 R?=R?_StringA_U_BMU_V50_StringPWRControl#8 R?=R?_StringA_U_BMU_V50_StringPWRControl#9 R?=R?_StringA_U_BMU_V50_StringPWRControl#10 R?=R?_StringA_U_BMU_V50_StringPWRControl#12 R?=R?_StringA_U_BMU_V50_StringPWRControl#13 R?=R?_StringA_U_BMU_V50_StringPWRControl#5 R?=R?_StringA_U_BMU_V50_StringPWRControl#2 R?=R?_StringA_U_BMU_V50_StringPWRControl#1 R?=R?_StringA_U_BMU_V50_StringPWRControl#6 R?=R?_StringA_U_BMU_V50_StringPWRControl#11 U?=U?_StringA_U_BMU_V50_StringPWRControl; ports CELLS_POS_MID=NetQ?_StringA_U_BMU_V50_StringPWRControl#1_S CHG_EN=NetU?#1_24 CP_EN=NetU?#1_33 DIVP=NetR?_StringA_U_BMU_V50_StringPWRControl#12_1 DSG_EN=NetU?#1_8 PCHG_EN=NetU?#1_50 PMON_EN=NetU?#1_17 POS=NetC?_StringA_U_BMU_V50_StringPWRControl#2_2 POS_CELLS=NetC?_StringA_U_BMU_V50_StringPWRControl#1_1
StringB/U_BMU_V50_StringPWRControl: designators C?=C?_StringB_U_BMU_V50_StringPWRControl#3 C?=C?_StringB_U_BMU_V50_StringPWRControl#6 C?=C?_StringB_U_BMU_V50_StringPWRControl#2 C?=C?_StringB_U_BMU_V50_StringPWRControl#1 C?=C?_StringB_U_BMU_V50_StringPWRControl#7 C?=C?_StringB_U_BMU_V50_StringPWRControl#5 C?=C?_StringB_U_BMU_V50_StringPWRControl#4 D?=D?_StringB_U_BMU_V50_StringPWRControl L?=L?_StringB_U_BMU_V50_StringPWRControl#1 L?=L?_StringB_U_BMU_V50_StringPWRControl#3 L?=L?_StringB_U_BMU_V50_StringPWRControl#5 L?=L?_StringB_U_BMU_V50_StringPWRControl#2 L?=L?_StringB_U_BMU_V50_StringPWRControl#4 L?=L?_StringB_U_BMU_V50_StringPWRControl#6 Q?=Q?_StringB_U_BMU_V50_StringPWRControl#3 Q?=Q?_StringB_U_BMU_V50_StringPWRControl#2 Q?=Q?_StringB_U_BMU_V50_StringPWRControl#5 Q?=Q?_StringB_U_BMU_V50_StringPWRControl#4 Q?=Q?_StringB_U_BMU_V50_StringPWRControl#7 Q?=Q?_StringB_U_BMU_V50_StringPWRControl#6 Q?=Q?_StringB_U_BMU_V50_StringPWRControl#1 R?=R?_StringB_U_BMU_V50_StringPWRControl#3 R?=R?_StringB_U_BMU_V50_StringPWRControl#4 R?=R?_StringB_U_BMU_V50_StringPWRControl#7 R?=R?_StringB_U_BMU_V50_StringPWRControl#8 R?=R?_StringB_U_BMU_V50_StringPWRControl#9 R?=R?_StringB_U_BMU_V50_StringPWRControl#10 R?=R?_StringB_U_BMU_V50_StringPWRControl#12 R?=R?_StringB_U_BMU_V50_StringPWRControl#13 R?=R?_StringB_U_BMU_V50_StringPWRControl#5 R?=R?_StringB_U_BMU_V50_StringPWRControl#2 R?=R?_StringB_U_BMU_V50_StringPWRControl#1 R?=R?_StringB_U_BMU_V50_StringPWRControl#6 R?=R?_StringB_U_BMU_V50_StringPWRControl#11 U?=U?_StringB_U_BMU_V50_StringPWRControl; ports CELLS_POS_MID=NetQ?_StringB_U_BMU_V50_StringPWRControl#1_S CHG_EN=NetU?#1_10 CP_EN=NetU?#1_26 DIVP=NetR?_StringB_U_BMU_V50_StringPWRControl#12_1 DSG_EN=NetU?#1_9 PCHG_EN=NetU?#1_29 PMON_EN=NetU?#1_41 POS=NetC?_StringA_U_BMU_V50_StringPWRControl#2_2 POS_CELLS=NetC?_StringB_U_BMU_V50_StringPWRControl#1_1

### Notes on the sheet
- (near Q?#2) Charge FET
- (near Q?#3) Discharge FET
- In TI Document SLVA729A (http://www.ti.com/lit/an/slva729a/slva729a.pdf), this is 1kΩ; however, the ZXMP10A13FTA is a 600mA device.  Setting this resistor to 33Ω gives a 500mA precharge current.  Adjust this value as needed.
- (near U?) MOSFET DRIVER N-CH
- Title
- MATTERNET
- PROPRIETRY & CONFIDENTIAL
  THE INFORMATION CONTAINS IN THIS DRAWING
  IS THE SOLE PROPERTY OF  MATTERNET Inc.
  ANY REPRODUCTION IN PART OR AS WHOLE
  WITHOUT A WRITTEN PERMISSION OF
  MATTERNET Inc. IS PROHIBITED
- Size:
- Date:
- File:
- C
- Number:
- Time:
- Revision:
- Sheet
- of
- 161 E. Evelyn Ave.
- Mountain View,
- CA 94041 USA

### Library data of the parts
C?#1-C?#3 C?#6 = CAP-Generic-0603: CAP CER 0.1UF 100V 20% X7R 0603; Manufacturer: Murata; Manufacturer Part Number: GCJ188R71E104KA12D; Supplier 1: Digi-Key; Supplier Part Number 1: 490-16477-1-ND; Stock 1: 2560; Pricing 1: 1=0.22, 10=0.152, 100=0.077, 500=0.0527, 1000=0.04662 (USD); Case/Package: 0603; Supplier 2: Mouser; Supplier Part Number 2: 81-GCJ188R71E104KA2D; Stock 2: 47905; Pricing 2: 1=0.21, 10=0.139, 50=0.139, 100=0.071, 1000=0.043, 10000=0.035 (USD)
C?#4 = CAP-Generic-1210: custinv: Ansync; custprt: 100-0200-000106; Option: AB
C?#5 C?#7 = CAP-Generic-0603: CAP CER 10000PF 50V X7R 0603; Manufacturer: TDK; Manufacturer Part Number: CGA3E2X7R1H103K080AE; Capacitance: 10nF; Tolerance: 10%; Supplier 1: Digi-Key; Supplier Part Number 1: 445-15955-1-ND; Stock 1: 42633; Pricing 1: 1=0.27, 10=0.186, 100=0.0944, 500=0.06458, 1000=0.05713 (USD); Mount: Surface Mount; Case/Package: 0603; Weight: 7.1E-05oz; Case Code (Metric): 1608; Case Code (Imperial): 0603; Min Operating Temperature: -55°C; Max Operating Temperature: 125°C; Package Quantity: 4000; Packaging: Tape and Reel; Voltage Rating: 50V; Dielectric: X7R; Termination: SMD/SMT; Voltage Rating (DC): 50V; Features: Soft Termination; Length: 0.063inch; Height: 0.8mm; Width: 0.031inch; Thickness: 0.035inch; Ratings: AEC-Q200
D? = CMP-2000-07025-1: Surface Mount Glass Passivated Rectifier, 5 A, 100 V, -65 to 150 degC, 2-Pin SMC, RoHS, Tape and Reel; Manufacturer: Diodes Inc; Reverse Current-Max: 10µA; Peak Current-Max: 100A; Average Rectified Current-Max: 5A; Reverse Voltage-Max [Vrrm]: 100V; Forward Voltage: 1.15V; Datasheet URL: http://www.diodes.com/_files/datasheets/ds16007.pdf; Package Description: 2-Pin Molded Component, Body 6.855 x 5.905 mm; Manufacturer URL: http://www.diodes.com/; Datasheet Version: Rev. 9-2, 09/2010; Package Reference: S5xC; Mounting Technology: SurfaceMount
L?#1-L?#6 = BLM18AG601SN1D: FERRITE BEAD 600 OHM 0603 1LN; ComponentLink1Description: Reference Spec; ComponentLink1URL: https://www.murata.com/en-us/products/productdata/8796738650142/ENFA0003.pdf; Supplier 1: Digi-Key; Supplier 2: Digi-Key; Supplier 3: Mouser; Supplier Part Number 1: 490-1014-1-ND; Supplier Part Number 2: 490-1014-2-ND; Supplier Part Number 3: 81-BLM11A601S
Q?#1 = FET-P-CH-Generic_OP4_0: P-Channel 100V 600mA (Ta) 625mW (Ta) Surface Mount SOT-23-3; Manufacturer 1: Diodes Zetex; custinv: Ansync; custprt: 100-0300-000087; Option: AB; Rise Time: 2.1ns; Gate to Source Voltage (Vgs): 20V; Fall Time: 3.3ns; Turn-Off Delay Time: 5.9ns; Turn-On Delay Time: 1.6ns; Rds On Max: 1R; Input Capacitance: 141pF; Number of Elements: 1; Continuous Drain Current (ID): -700mA; Drain to Source Resistance: 1.45R; Power Dissipation: 806mW; Threshold Voltage: -4V; Element Configuration: Single; Drain to Source Breakdown Voltage: -100V; Current Rating: -500mA; Supplier 1: Digi-Key; Supplier Part Number 1: ZXMP10A13FCT-ND; Manufacturer Part Number 1: ZXMP10A13FTA; Stock 1: 331879; Pricing 1: 1=0.57000, 10=0.49100, 100=0.34070, 500=0.26602, 1000=0.21622 (USD); RoHS: Yes; Mount: Surface Mount; Case/Package: SOT-23; Number of Pins: 3; Weight: 0.000282oz; Min Operating Temperature: -55°C; Max Operating Temperature: 150°C; Packaging: Tape and Reel; Package Quantity: 3000; Max Power Dissipation: 625mW; Drain to Source Voltage (Vdss): 100V; Number of Channels: 1; Voltage Rating (DC): -100V; On-State Resistance: 1R; Length: 3.04mm; Height: 1.02mm; Width: 1.4mm; Radiation Hardening: No; REACH SVHC: No SVHC; Lead Free: Lead Free; ComponentLink1URL: https://datasheet.ciiva.com/6383/zxmp10a13f-6383089.pdf?src-supplier=Digi-Key; ComponentLink1Description: https://datasheet.ciiva.com/6383/zxmp10a13f-6383089.pdf?src-supplier=Digi-Key; ComponentLink2URL: https://datasheet.ciiva.com/11175/zxmp10a13f-11175011.pdf?src-supplier=Avnet; ComponentLink2Description: https://datasheet.ciiva.com/11175/zxmp10a13f-11175011.pdf?src-supplier=Avnet; ComponentLink3URL: https://datasheet.ciiva.com/17097/zxmp10a13fta-17097946.pdf?src-supplier=Allied+Electronics; ComponentLink3Description: https://datasheet.ciiva.com/17097/zxmp10a13fta-17097946.pdf?src-supplier=Allied+Electronics; ComponentLink4URL: https://datasheet.ciiva.com/22712/1915646-22712428.pdf?src-supplier=Element14; ComponentLink4Description: https://datasheet.ciiva.com/22712/1915646-22712428.pdf?src-supplier=Element14; ComponentLink5URL: https://datasheet.ciiva.com/16387/zxmp10a13f-16387581.pdf?src-supplier=Future+Electronics; ComponentLink5Description: https://datasheet.ciiva.com/16387/zxmp10a13f-16387581.pdf?src-supplier=Future+Electronics; ComponentLink6URL: https://datasheet.ciiva.com/6383/zxmp10a13f-6383087.pdf?src-supplier=Digi-Key; ComponentLink6Description: https://datasheet.ciiva.com/6383/zxmp10a13f-6383087.pdf?src-supplier=Digi-Key
Q?#2-Q?#7 = BSC030N08NS5ATMA1: MOSFET N-CH 80V 100A 8TDSON; Manufacturer: Infineon; Rds On Max: 3mR; Input Capacitance: 5.6nF; Max Power Dissipation: 2.5W; Gate to Source Voltage (Vgs): 20V; Turn-On Delay Time: 20ns; Rise Time: 12ns; Turn-Off Delay Time: 43ns; Fall Time: 13ns; Element Configuration: Single; Number of Channels: 1; Drain to Source Resistance: 4.5mR; Supplier 1: Digi-Key; Supplier Part Number 1: BSC030N08NS5ATMA1CT-ND; Manufacturer Part Number: BSC030N08NS5ATMA1; Stock 1: 0; Pricing 1: 1=2.41, 10=2.181, 100=1.7526, 500=1.36316, 1000=1.12947 (USD); Mount: Surface Mount; Number of Pins: 8; Weight: 0.01787oz; Min Operating Temperature: -55°C; Max Operating Temperature: 150°C; Packaging: Tape and Reel; Drain to Source Voltage (Vdss): 80V; Continuous Drain Current (ID): 100A; Drain to Source Breakdown Voltage: 80V; Package Quantity: 5000; Max Dual Supply Voltage: 80V; Lead Free: Contains Lead; Halogen Free: Halogen Free; Supplier 2: Mouser; Supplier Part Number 2: 726-BSC030N08NS5ATMA; Stock 2: 0; Pricing 2: 1=2.03, 10=1.72, 50=1.72, 100=1.38, 1000=0.997, 10000=0.894 (USD); Supplier 3: Newark; Supplier Part Number 3: 12AC9442; Stock 3: 3452; Pricing 3: 1=2.03, 10=1.72, 25=1.61, 50=1.49, 100=1.38, 250=1.3, 500=1.21, 1000=0.997 (USD)
R?#1 = R-Generic-1206: custinv: Ansync; custprt: 100-0100-000238; Option: AB
R?#2-R?#6 R?#10-R?#13 = R-Generic-0603: custprt: 100-0110-000153; custinv: Ansync; Option: AB
R?#7-R?#9 = R-Generic-0402: custinv: Ansync; custprt: 100-0120-000002; Option: N
U? = bq76200: High-voltage battery pack front-end charge/discharge high-side NFET driver; ComponentLink1Description: Datasheet; ComponentLink1URL: http://www.ti.com/lit/ds/symlink/bq76200.pdf; Supplier 1: Digi-Key; Supplier 2: Arrow; Supplier 3: Mouser; Supplier Part Number 1: 296-43273-1-ND; Supplier Part Number 2: BQ76200PWR; Supplier Part Number 3: 595-BQ76200PWR